# EAGLE schematic BiodataModular_008_SMD (EAGLE 9.6.2)
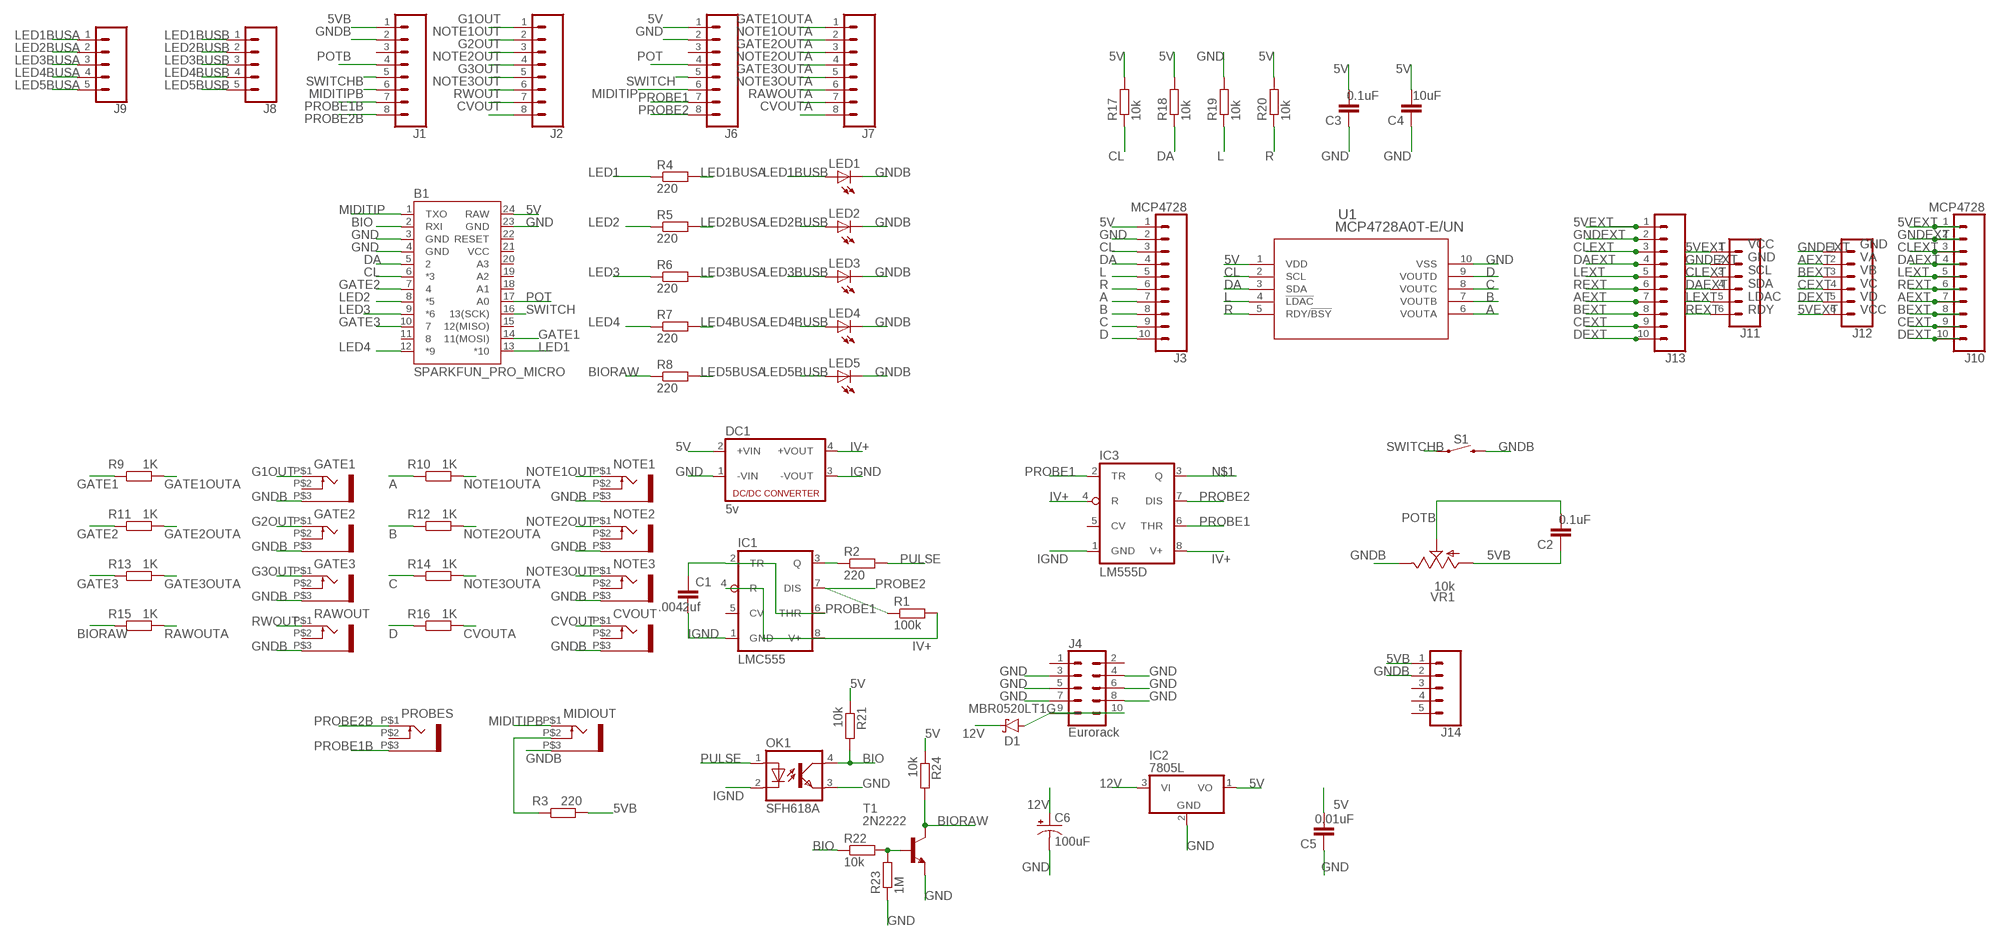
[diagram p0: schematic, sheet 1]

## Parts
B1  SPARKFUN_PRO_MICRO  [SPARKFUN_PRO_MICRO]
C1  .0042uf  C-EUC1206  [C1206]
C2  0.1uF  C-EUC1206  [C1206]
C3  0.1uF  C-EUC1206  [C1206]
C4  10uF  C-EUC1206  [C1206]
C5  0.01uF  C-EUC1206  [C1206]
C6  100uF  CPOL-USB45181A  [B45181A]
CVOUT  WQP-PJ301M-12_JACK  [WQP-PJ301M-12_JACK]
D1  MBR0520LT1G  SCHOTTKY_MBR0520LT1GDO-219  [SODFL3718X115]
DC1  5v  NME  [NME]
GATE1  WQP-PJ301M-12_JACK  [WQP-PJ301M-12_JACK]
GATE2  WQP-PJ301M-12_JACK  [WQP-PJ301M-12_JACK]
GATE3  WQP-PJ301M-12_JACK  [WQP-PJ301M-12_JACK]
IC1  LMC555  LM555N  [DIL08]
IC2  7805L  [TO92]
IC3  LM555D  [SO08]
J1  CONN_08"  [1X08]
J2  CONN_08"  [1X08]
J3  MCP4728  CONN_10"  [1X10]
J4  Eurorack  CONN_05X2PTH  [2X5]
J6  CONN_08"  [1X08]
J7  CONN_08"  [1X08]
J8  CONN_05  [1X05]
J9  CONN_05  [1X05]
J10  MCP4728  CONN_10"  [1X10]
J11  CONN_06SILK_FEMALE_PTH  [1X06]
J12  CONN_06SILK_FEMALE_PTH  [1X06]
J13  CONN_10SMD_MALE  [1X10_SMD_MALE]
J14  CONN_05  [1X05]
LED1  LED3MM  [LED3MM]
LED2  LED3MM  [LED3MM]
LED3  LED3MM  [LED3MM]
LED4  LED3MM  [LED3MM]
LED5  LED3MM  [LED3MM]
MIDIOUT  WQP-PJ301M-12_JACK  [WQP-PJ301M-12_JACK]
NOTE1  WQP-PJ301M-12_JACK  [WQP-PJ301M-12_JACK]
NOTE2  WQP-PJ301M-12_JACK  [WQP-PJ301M-12_JACK]
NOTE3  WQP-PJ301M-12_JACK  [WQP-PJ301M-12_JACK]
OK1  SFH618A  SFH618A-5  [DIP4]
PROBES  WQP-PJ301M-12_JACK  [WQP-PJ301M-12_JACK]
R1  100k  R-EU_M1206  [M1206]
R2  220  R-EU_M1206  [M1206]
R3  220  R-EU_M1206  [M1206]
R4  220  R-EU_M1206  [M1206]
R5  220  R-EU_M1206  [M1206]
R6  220  R-EU_M1206  [M1206]
R7  220  R-EU_M1206  [M1206]
R8  220  R-EU_M1206  [M1206]
R9  1K  R-EU_M1206  [M1206]
R10  1K  R-EU_M1206  [M1206]
R11  1K  R-EU_M1206  [M1206]
R12  1K  R-EU_M1206  [M1206]
R13  1K  R-EU_M1206  [M1206]
R14  1K  R-EU_M1206  [M1206]
R15  1K  R-EU_M1206  [M1206]
R16  1K  R-EU_M1206  [M1206]
R17  10k  R-EU_M1206  [M1206]
R18  10k  R-EU_M1206  [M1206]
R19  10k  R-EU_M1206  [M1206]
R20  10k  R-EU_M1206  [M1206]
R21  10k  R-EU_M1206  [M1206]
R22  10k  R-EU_M1206  [M1206]
R23  1M  R-EU_M1206  [M1206]
R24  10k  R-EU_M1206  [M1206]
RAWOUT  WQP-PJ301M-12_JACK  [WQP-PJ301M-12_JACK]
S1  MOMENTARY-SWITCH-SPST-PTH-6.0MM  [TACTILE_SWITCH_PTH_6.0MM]
T1  2N2222  [TO92-EBC-OVAL]
U1  MCP4728A0T-E/UN  [MSOP10_MC]
VR1  10k  US-EVUF3M  [EVUFXM]

## Nets
5V: B1.24(RAW) C3.2 C4.2 C5.2 DC1.2(+VIN) IC2.1(VO) J3.1 J6.1 R17.2 R18.2 R20.2 R21.1 R24.1 U1.1(VDD)
5VB: C2.1 J1.1 J14.1 R3.2 VR1.1(A)
5VEXT: J10.1 J11.1 J12.6 J13.1
12V: C6.+ D1.1(C) IC2.3(VI)
A: J3.7 R10.1 U1.6(VOUTA)
AEXT: J10.7 J12.2 J13.7
B: J3.8 R12.1 U1.7(VOUTB)
BEXT: J10.8 J12.3 J13.8
BIO: B1.2(RXI) OK1.4(COL) R21.2 R22.1
BIORAW: R8.1 R15.1 R24.2 T1.C
C: J3.9 R14.1 U1.8(VOUTC)
CEXT: J10.9 J12.4 J13.9
CL: B1.6(*3) J3.3 R17.1 U1.2(SCL)
CLEXT: J10.3 J11.3 J13.3
CVOUT: CVOUT.P$1 J2.8
CVOUTA: J7.8 R16.2
D: J3.10 R16.1 U1.9(VOUTD)
DA: B1.5 J3.4 R18.1 U1.3(SDA)
DAEXT: J10.4 J11.4 J13.4
DEXT: J10.10 J12.5 J13.10
G1OUT: GATE1.P$1 J2.1
G2OUT: GATE2.P$1 J2.3
G3OUT: GATE3.P$1 J2.5
GATE1: B1.14(11(MOSI)) R9.1
GATE1OUTA: J7.1 R9.2
GATE2: B1.7 R11.1
GATE2OUTA: J7.3 R11.2
GATE3: B1.10 R13.1
GATE3OUTA: J7.5 R13.2
GND: B1.3(GND) B1.4(GND) B1.23(GND) C3.1 C4.1 C5.1 C6.- DC1.1(-VIN) IC2.2(GND) J3.2 J4.3 J4.4 J4.5 J4.6 J4.7 J4.8 J6.2 OK1.3(EMIT) R19.2 R23.1 T1.E U1.10(VSS)
GNDB: CVOUT.P$3 GATE1.P$3 GATE2.P$3 GATE3.P$3 J1.2 J14.2 LED1.K(C) LED2.K(C) LED3.K(C) LED4.K(C) LED5.K(C) MIDIOUT.P$3 NOTE1.P$3 NOTE2.P$3 NOTE3.P$3 RAWOUT.P$3 S1.3 VR1.3(E)
GNDEXT: J10.2 J11.2 J12.1 J13.2
IGND: C1.2 DC1.3(-VOUT) IC1.1(GND) IC3.1(GND) OK1.2(C)
IV+: DC1.4(+VOUT) IC1.4(R) IC1.8(V+) IC3.4(R) IC3.8(V+) R1.2
L: J3.5 R19.1 U1.4(!LDAC)
LED1: B1.13(*10) R4.1
LED1BUSA: J9.1 R4.2
LED1BUSB: J8.1 LED1.A
LED2: B1.8(*5) R5.1
LED2BUSA: J9.2 R5.2
LED2BUSB: J8.2 LED2.A
LED3: B1.9(*6) R6.1
LED3BUSA: J9.3 R6.2
LED3BUSB: J8.3 LED3.A
LED4: B1.12(*9) R7.1
LED4BUSA: J9.4 R7.2
LED4BUSB: J8.4 LED4.A
LED5BUSA: J9.5 R8.2
LED5BUSB: J8.5 LED5.A
LEXT: J10.5 J11.5 J13.5
MIDITIP: B1.1(TXO) J6.6
MIDITIPB: J1.6 MIDIOUT.P$1
N$1: IC1.3(Q) IC3.3(Q) R2.1
N$2: MIDIOUT.P$2 R3.1
N$7: D1.2(A) J4.9 J4.10
N$8: R22.2 R23.2 T1.B
NOTE1OUT: J2.2 NOTE1.P$1
NOTE1OUTA: J7.2 R10.2
NOTE2OUT: J2.4 NOTE2.P$1
NOTE2OUTA: J7.4 R12.2
NOTE3OUT: J2.6 NOTE3.P$1
NOTE3OUTA: J7.6 R14.2
POT: B1.17(A0) J6.4
POTB: C2.2 J1.4 VR1.2(S)
PROBE1: C1.1 IC1.2(TR) IC1.6(THR) IC3.2(TR) IC3.6(THR) J6.7
PROBE1B: J1.7 PROBES.P$3
PROBE2: IC1.7(DIS) IC3.7(DIS) J6.8 R1.1
PROBE2B: J1.8 PROBES.P$1
PULSE: OK1.1(A) R2.2
R: J3.6 R20.1 U1.5(RDY/!BSY)
RAWOUTA: J7.7 R15.2
REXT: J10.6 J11.6 J13.6
RWOUT: J2.7 RAWOUT.P$1
SWITCH: B1.16(13(SCK)) J6.5
SWITCHB: J1.5 S1.1
Unconnected: B1.11 B1.15(12(MISO)) B1.18(A1) B1.19(A2) B1.20(A3) B1.22(RESET) CVOUT.P$2 GATE1.P$2 GATE2.P$2 GATE3.P$2 IC1.5(CV) IC3.5(CV) J1.3 J4.1 J4.2 J6.3 J14.3 J14.4 J14.5 NOTE1.P$2 NOTE2.P$2 NOTE3.P$2 PROBES.P$2 RAWOUT.P$2

## Notes on the sheet
- VCC
  GND
  SCL
  SDA
  LDAC
  RDY
- GND
  VA
  VB
  VC
  VD
  VCC

## Power pins joined to a net without a drawn wire
VCC: B1.21(VCC)

## Library data of the parts
B1 = SparkFun-Boards:SPARKFUN_PRO_MICRO: SparkFun Pro Micro Atmega32U4 compatible footprint. SparkFun Products: 3.3V/8MHz <https://www.sparkfun.com/products/12587> 5V/16MHz <https://www.sparkfun.com/products/12640>
C1-C5 = rcl:C-EU: CAPACITOR, European symbol; SPICEPREFIX: C
C6 = adafruit:CPOL-US: POLARIZED CAPACITOR, American symbol
CVOUT GATE1-GATE3 MIDIOUT NOTE1-NOTE3 PROBES RAWOUT = thonkiconn:WQP-PJ301M-12_JACK
D1 = Diode:SCHOTTKY_: Schottky Diode - Popular parts; CATEGORY: Diode; DESCRIPTION: DIODE SCHOTTKY 20V 500MA SOD123; MANUFACTURER: ON Semiconductor; MPN: MBR0520LT1G; SUB-CATEGORY: Schottky
DC1 = dc-dc-converter:NME: DC-DC CONVERTER; MF: C & D TECHNOLOGIES, INC; MPN: NME1205D; OC_FARNELL: 1021466; OC_NEWARK: 98B8198
IC1 = linear:*555: TIMER Changed DIP package to have round (not oval) pin pads http://www.ladyada.net/library/pcb/eaglelibrary.html
IC2 = adafruit:78*: Positive VOLTAGE REGULATOR Added bigger pads to the TO-92 package
IC3 = adafruit:*555: TIMER Changed DIP package to have round (not oval) pin pads http://www.ladyada.net/library/pcb/eaglelibrary.html
J1 J2 J6 J7 = SparkFun-Connectors:CONN_08: Multi connection point. Often used as Generic Header-pin footprint for 0.1 inch spaced/style header connections On any of the 0.1 inch spaced packages, you can populate with these: Break Away Headers - Straight <https://www.sparkfun.com/products/116> (PRT-00116) Break Away Male Headers - Right Angle <https://www.sparkfun.com/products/553> (PRT-00553) Female Headers <https://www.sparkfun.com/products/115> (PRT-00115) Break Away Headers - Machine Pin <https://www.sparkfun.com/products/117> (PRT-00117) Break Away Female Headers - Swiss Machine Pin <https://www.sparkfun.com/products/743> (PRT-00743) Arduino Stackable Header - 8 Pin <https://www.sparkfun.com/products/9279> (PRT-09279) For SCREWTERMINALS and SPRING TERMINALS visit here: Screw Terimnals on SparkFun.com <https://www.sparkfun.com/search/results?term=Screw+Terminals> (5mm/3.5mm/2.54mm spacing) This device is also useful as a general connection point to wire up your design to another part of your project. Our various solder wires solder well into these plated through hole pads. Hook-Up Wire - Assortment (Stranded, 22 AWG) <https://www.sparkfun.com/products/11375> (PRT-11375) Hook-Up Wire - Assortment (Solid Core, 22 AWG) <https://www.sparkfun.com/products/11367> (PRT-11367) View the entire wire category on our website here <https://www.sparkfun.com/categories/141> Special notes: Molex polarized connector foot print use with SKU : PRT-08231 with associated crimp pins and housings. 1MM SMD Version SKU: PRT-10208 NOTES ON THE VARIANTS LOCK and LOCK_LONGPADS... This footprint was designed to help hold the alignment of a through-hole component (i.e. 6-pin header) while soldering it into place. You may notice that each hole has been shifted either up or down by 0.005 of an inch from it's more standard position (which is a perfectly straight line). This slight alteration caused the pins (the squares in the middle) to touch the edges of the holes. Because they are alternating, it causes a "brace" to hold the component in place. 0.005 has proven to be the perfect amount of "off-center" position when using our standard breakaway headers. Although looks a little odd when you look at the bare footprint, once you have a header in there, the alteration is very hard to notice. Also,if you push a header all the way into place, it is covered up entirely on the bottom side.; PROD_ID: CONN-08438
J3 J10 = SparkFun-Connectors:CONN_10: Multi connection point. Often used as Generic Header-pin footprint for 0.1 inch spaced/style header connections On any of the 0.1 inch spaced packages, you can populate with these: Break Away Headers - Straight <https://www.sparkfun.com/products/116> (PRT-00116) Break Away Male Headers - Right Angle <https://www.sparkfun.com/products/553> (PRT-00553) Female Headers <https://www.sparkfun.com/products/115> (PRT-00115) Break Away Headers - Machine Pin <https://www.sparkfun.com/products/117> (PRT-00117) Break Away Female Headers - Swiss Machine Pin <https://www.sparkfun.com/products/743> (PRT-00743) Arduino Stackable Header - 10 Pin <https://www.sparkfun.com/products/11376> (PRT-11376) For SCREWTERMINALS and SPRING TERMINALS visit here: Screw Terimnals on SparkFun.com <https://www.sparkfun.com/search/results?term=Screw+Terminals> (5mm/3.5mm/2.54mm spacing) This device is also useful as a general connection point to wire up your design to another part of your project. Our various solder wires solder well into these plated through hole pads. Hook-Up Wire - Assortment (Stranded, 22 AWG) <https://www.sparkfun.com/products/11375> (PRT-11375) Hook-Up Wire - Assortment (Solid Core, 22 AWG) <https://www.sparkfun.com/products/11367> (PRT-11367) View the entire wire category on our website here <https://www.sparkfun.com/categories/141> Special notes: Molex polarized connector foot print use with SKU : PRT-08231 with associated crimp pins and housings. 1MM SMD Version SKU: PRT-10208 NOTES ON THE VARIANTS LOCK and LOCK_LONGPADS... This footprint was designed to help hold the alignment of a through-hole component (i.e. 6-pin header) while soldering it into place. You may notice that each hole has been shifted either up or down by 0.005 of an inch from it's more standard position (which is a perfectly straight line). This slight alteration caused the pins (the squares in the middle) to touch the edges of the holes. Because they are alternating, it causes a "brace" to hold the component in place. 0.005 has proven to be the perfect amount of "off-center" position when using our standard breakaway headers. Although looks a little odd when you look at the bare footprint, once you have a header in there, the alteration is very hard to notice. Also,if you push a header all the way into place, it is covered up entirely on the bottom side.; PROD_ID: CONN-11563
J4 = SparkFun-Connectors:CONN_05X2: Multi connection point. Often used as Generic Header-pin footprint for 0.1 inch spaced/style header connections For AVR SPI programming port, see special device with nice symbol: "AVR_SPI_PROG_5x2.dev" You can populate with any combo of single row headers, but if you'd like an exact match, check these: 2x5 AVR ICSP Male Header <https://www.sparkfun.com/products/778> (PRT-00778) 2x5 Pin Shrouded Header <https://www.sparkfun.com/products/8506> (PRT-08506) On any of the 0.1 inch spaced packages, you can populate with these: Break Away Headers - Straight <https://www.sparkfun.com/products/116> (PRT-00116) Break Away Male Headers - Right Angle <https://www.sparkfun.com/products/553> (PRT-00553) Female Headers <https://www.sparkfun.com/products/115> (PRT-00115) Break Away Headers - Machine Pin <https://www.sparkfun.com/products/117> (PRT-00117) Break Away Female Headers - Swiss Machine Pin <https://www.sparkfun.com/products/743> (PRT-00743) Special note: the shrouded connector mates well with our 5x2 ribbon cables: 2x5 Pin IDC Ribbon Cable <https://www.sparkfun.com/products/8535> (PRT-08535); PROD_ID: CONN-08499; SF_ID: PRT-0778
J8 J9 J14 = SparkFun-Connectors:CONN_05: Multi connection point. Often used as Generic Header-pin footprint for 0.1 inch spaced/style header connections On any of the 0.1 inch spaced packages, you can populate with these: Break Away Headers - Straight <https://www.sparkfun.com/products/116> (PRT-00116) Break Away Male Headers - Right Angle <https://www.sparkfun.com/products/553> (PRT-00553) Female Headers <https://www.sparkfun.com/products/115> (PRT-00115) Break Away Headers - Machine Pin <https://www.sparkfun.com/products/117> (PRT-00117) Break Away Female Headers - Swiss Machine Pin <https://www.sparkfun.com/products/743> (PRT-00743) For SCREWTERMINALS and SPRING TERMINALS visit here: Screw Terimnals on SparkFun.com <https://www.sparkfun.com/search/results?term=Screw+Terminals> (5mm/3.5mm/2.54mm spacing) This device is also useful as a general connection point to wire up your design to another part of your project. Our various solder wires solder well into these plated through hole pads. Hook-Up Wire - Assortment (Stranded, 22 AWG) <https://www.sparkfun.com/products/11375> (PRT-11375) Hook-Up Wire - Assortment (Solid Core, 22 AWG) <https://www.sparkfun.com/products/11367> (PRT-11367) View the entire wire category on our website here <https://www.sparkfun.com/categories/141> Special notes: Molex polarized connector foot print use with SKU : PRT-08231 with associated crimp pins and housings. 1MM SMD Version SKU: PRT-10208
J11 J12 = SparkFun-Connectors:CONN_06: Multi connection point. Often used as Generic Header-pin footprint for 0.1 inch spaced/style header connections On any of the 0.1 inch spaced packages, you can populate with these: Break Away Headers - Straight <https://www.sparkfun.com/products/116> (PRT-00116) Break Away Male Headers - Right Angle <https://www.sparkfun.com/products/553> (PRT-00553) Female Headers <https://www.sparkfun.com/products/115> (PRT-00115) Break Away Headers - Machine Pin <https://www.sparkfun.com/products/117> (PRT-00117) Break Away Female Headers - Swiss Machine Pin <https://www.sparkfun.com/products/743> (PRT-00743) Arduino Stackable Header - 6 Pin <https://www.sparkfun.com/products/9280> (PRT-09280) For SCREWTERMINALS and SPRING TERMINALS visit here: Screw Terimnals on SparkFun.com <https://www.sparkfun.com/search/results?term=Screw+Terminals> (5mm/3.5mm/2.54mm spacing) This device is also useful as a general connection point to wire up your design to another part of your project. Our various solder wires solder well into these plated through hole pads. Hook-Up Wire - Assortment (Stranded, 22 AWG) <https://www.sparkfun.com/products/11375> (PRT-11375) Hook-Up Wire - Assortment (Solid Core, 22 AWG) <https://www.sparkfun.com/products/11367> (PRT-11367) View the entire wire category on our website here <https://www.sparkfun.com/categories/141>; PROD_ID: CONN-08437
J13 = SparkFun-Connectors:CONN_10: Multi connection point. Often used as Generic Header-pin footprint for 0.1 inch spaced/style header connections On any of the 0.1 inch spaced packages, you can populate with these: Break Away Headers - Straight <https://www.sparkfun.com/products/116> (PRT-00116) Break Away Male Headers - Right Angle <https://www.sparkfun.com/products/553> (PRT-00553) Female Headers <https://www.sparkfun.com/products/115> (PRT-00115) Break Away Headers - Machine Pin <https://www.sparkfun.com/products/117> (PRT-00117) Break Away Female Headers - Swiss Machine Pin <https://www.sparkfun.com/products/743> (PRT-00743) Arduino Stackable Header - 10 Pin <https://www.sparkfun.com/products/11376> (PRT-11376) For SCREWTERMINALS and SPRING TERMINALS visit here: Screw Terimnals on SparkFun.com <https://www.sparkfun.com/search/results?term=Screw+Terminals> (5mm/3.5mm/2.54mm spacing) This device is also useful as a general connection point to wire up your design to another part of your project. Our various solder wires solder well into these plated through hole pads. Hook-Up Wire - Assortment (Stranded, 22 AWG) <https://www.sparkfun.com/products/11375> (PRT-11375) Hook-Up Wire - Assortment (Solid Core, 22 AWG) <https://www.sparkfun.com/products/11367> (PRT-11367) View the entire wire category on our website here <https://www.sparkfun.com/categories/141> Special notes: Molex polarized connector foot print use with SKU : PRT-08231 with associated crimp pins and housings. 1MM SMD Version SKU: PRT-10208 NOTES ON THE VARIANTS LOCK and LOCK_LONGPADS... This footprint was designed to help hold the alignment of a through-hole component (i.e. 6-pin header) while soldering it into place. You may notice that each hole has been shifted either up or down by 0.005 of an inch from it's more standard position (which is a perfectly straight line). This slight alteration caused the pins (the squares in the middle) to touch the edges of the holes. Because they are alternating, it causes a "brace" to hold the component in place. 0.005 has proven to be the perfect amount of "off-center" position when using our standard breakaway headers. Although looks a little odd when you look at the bare footprint, once you have a header in there, the alteration is very hard to notice. Also,if you push a header all the way into place, it is covered up entirely on the bottom side.; PROD_ID: CONN-11291
LED1-LED5 = adafruit:LED: LED OSRAM: - CHIPLED LG R971, LG N971, LY N971, LG Q971, LY Q971, LO R971, LY R971 LH N974, LH R974 LS Q976, LO Q976, LY Q976 LO Q996 - Hyper CHIPLED LW Q18S LB Q993, LB Q99A, LB R99A - SideLED LS A670, LO A670, LY A670, LG A670, LP A670 LB A673, LV A673, LT A673, LW A673 LH A674 LY A675 LS A676, LA A676, LO A676, LY A676, LW A676 LS A679, LY A679, LG A679 - Hyper Micro SIDELED® LS Y876, LA Y876, LO Y876, LY Y876 LT Y87S - SmartLED LW L88C, LW L88S LB L89C, LB L89S, LG L890 LS L89K, LO L89K, LY L89K LS L896, LA L896, LO L896, LY L896 - TOPLED LS T670, LO T670, LY T670, LG T670, LP T670 LSG T670, LSP T670, LSY T670, LOP T670, LYG T670 LG T671, LOG T671, LSG T671 LB T673, LV T673, LT T673, LW T673 LH T674 LS T676, LA T676, LO T676, LY T676, LB T676, LH T676, LSB T676, LW T676 LB T67C, LV T67C, LT T67C, LS T67K, LO T67K, LY T67K, LW E67C LS E67B, LA E67B, LO E67B, LY E67B, LB E67C, LV E67C, LT E67C LW T67C LS T679, LY T679, LG T679 LS T770, LO T770, LY T770, LG T770, LP T770 LB T773, LV T773, LT T773, LW T773 LH T774 LS E675, LA E675, LY E675, LS T675 LS T776, LA T776, LO T776, LY T776, LB T776 LHGB T686 LT T68C, LB T68C - Hyper Mini TOPLED® LB M676 - Mini TOPLED Santana® LG M470 LS M47K, LO M47K, LY M47K Source: http://www.osram.convergy.de/
OK1 = optocoupler:SFH618?*: Optocoupler, Phototransistor Output, Low Input Current Source: Data sheet <http://www.vishay.com/docs/83673/sfh618.pdf>; MF: VISHAY/TELEFUNKEN; MPN: SFH618A-5; OC_FARNELL: 1469593; OC_NEWARK: 59K0259
R1-R24 = rcl:R-EU_: RESISTOR, European symbol; SPICEPREFIX: R
S1 = SparkFun-Switches:MOMENTARY-SWITCH-SPST: Momentary Switch (Pushbutton) - SPST Normally-open (NO) SPST momentary switches (buttons, pushbuttons). Variants PTH-12MM - 12mm square, through-hole Momentary Pushbutton Switch - 12mm Square <https://www.sparkfun.com/products/9190> (COM-09190) PTH-6.0MM, PTH-6.0MM-KIT - 6.0mm square, through-hole Mini Pushbutton Switch <https://www.sparkfun.com/products/97> (COM-00097) KIT package intended for soldering kit's - only one side of pads' copper is exposed. PTH-RIGHT-ANGLE-KIT - Right-angle, through-hole Right Angle Tactile Button <https://www.sparkfun.com/products/10791> - Used on SparkFun BigTime Watch Kit <https://www.sparkfun.com/products/11734> SMD-12MM - 12mm square, surface-mount Tactile Button - SMD (12mm) <https://www.sparkfun.com/products/12993> (COM-12993) Used on SparkFun PicoBoard <https://www.sparkfun.com/products/11888> SMD-4.5MM - 4.5mm Square Trackball Switch Used on SparkFun Blackberry Trackballer Breakout <https://www.sparkfun.com/products/13169> SMD-4.6MMX2.8MM - 4.60mm x 2.80mm, surface mount Used on SparkFun SAMD21 Mini Breakout <https://www.sparkfun.com/products/13664> SMD-5.2MM, SMD-5.2-REDUNDANT - 5.2mm square, surface-mount Mini Pushbutton Switch - SMD <https://www.sparkfun.com/products/8720> (COM-08720) Used on Arduino Pro Mini <https://www.sparkfun.com/products/11114> REDUNDANT package connects both switch circuits together SMD-6.0X3.5MM - 6.0 x 3.5mm, surface mount Momentary Reset Switch SMD <https://www.sparkfun.com/products/8229> (COM-08229) SMD-6.2MM-TALL - 6.2mm square, surface mount Tactile Button - SMD (6mm) <https://www.sparkfun.com/products/12992> Used on SparkFun Digital Sandbox <https://www.sparkfun.com/products/12651> SMD-RIGHT-ANGLE - Right-angle, surface mount Used on SparkFun Block for Intel® Edison - Arduino <https://www.sparkfun.com/products/13036>; PROD_ID: SWCH-08441; SF_SKU: COM-00097
T1 = adafruit:2N2222: NPN TRANSISTOR Big oval pads
U1 = MCP4728:MCP4728A0T-E/UN; MANUFACTURER_PART_NUMBER: MCP4728A0TEUN; VENDOR: Microchip
VR1 = pot:US-EVU: 9 mm Square Rotary Potentiometers Source: Panasonic